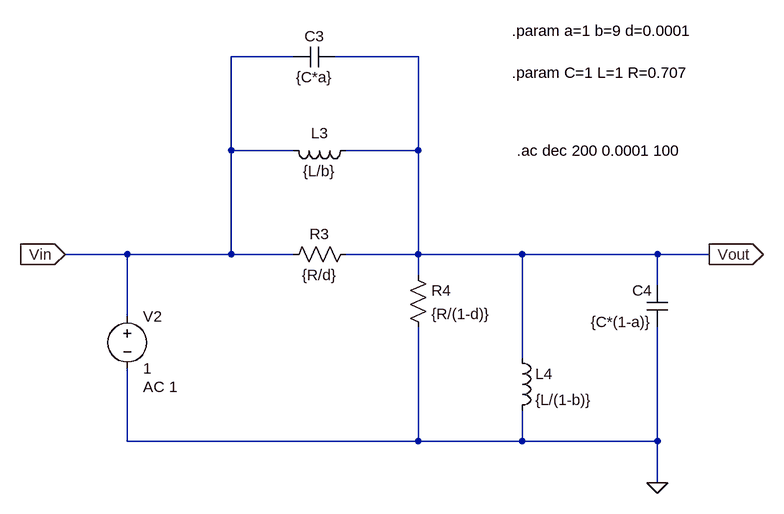
[diagram p0: schematic Draft1.asc]
Draft1.asc, the LTspice schematic file:
Version 4.1
SHEET 1 928 792
WIRE -1232 96 -1328 96
WIRE -1040 96 -1168 96
WIRE -1328 240 -1328 96
WIRE -1232 240 -1328 240
WIRE -1040 240 -1040 96
WIRE -1040 240 -1152 240
WIRE -1488 400 -1584 400
WIRE -1328 400 -1328 240
WIRE -1328 400 -1488 400
WIRE -1232 400 -1328 400
WIRE -1040 400 -1040 240
WIRE -1040 400 -1152 400
WIRE -880 400 -1040 400
WIRE -672 400 -880 400
WIRE -592 400 -672 400
WIRE -1040 432 -1040 400
WIRE -672 448 -672 400
WIRE -1488 496 -1488 400
WIRE -880 560 -880 400
WIRE -1488 688 -1488 576
WIRE -1040 688 -1040 512
WIRE -1040 688 -1488 688
WIRE -880 688 -880 640
WIRE -880 688 -1040 688
WIRE -672 688 -672 512
WIRE -672 688 -880 688
WIRE -672 752 -672 688
FLAG -672 752 0
FLAG -1584 400 Vin
IOPIN -1584 400 In
FLAG -592 400 Vout
IOPIN -592 400 Out
SYMBOL cap -1168 80 R90
WINDOW 0 0 32 VBottom 2
WINDOW 3 32 32 VTop 2
SYMATTR InstName C3
SYMATTR Value {C*a}
SYMBOL ind -1136 224 R90
WINDOW 0 5 56 VBottom 2
WINDOW 3 32 56 VTop 2
SYMATTR InstName L3
SYMATTR Value {L/b}
SYMBOL res -1248 416 R270
WINDOW 0 32 56 VTop 2
WINDOW 3 0 56 VBottom 2
SYMATTR InstName R3
SYMATTR Value {R/d}
SYMBOL res -1056 416 R0
SYMATTR InstName R4
SYMATTR Value {R/(1-d)}
SYMBOL ind -896 544 R0
SYMATTR InstName L4
SYMATTR Value {L/(1-b)}
SYMBOL cap -656 512 R180
WINDOW 0 24 56 Left 2
WINDOW 3 24 8 Left 2
SYMATTR InstName C4
SYMATTR Value {C*(1-a)}
SYMBOL voltage -1488 480 R0
WINDOW 123 24 124 Left 2
WINDOW 39 0 0 Left 0
SYMATTR InstName V2
SYMATTR Value 1
SYMATTR Value2 AC 1
TEXT -896 56 Left 2 !.param a=1 b=9 d=0.0001
TEXT -896 120 Left 2 !.param C=1 L=1 R=0.707
TEXT -888 240 Left 2 !.ac dec 200 0.0001 100

The netlist it stands for:
* Draft1.asc
C3 Vout Vin {C*a}
L3 Vout Vin {L/b}
R3 Vin Vout {R/d}
R4 Vout 0 {R/(1-d)}
L4 Vout 0 {L/(1-b)}
C4 0 Vout {C*(1-a)}
V2 Vin 0 1 AC 1
.param a=1 b=9 d=0.0001
.param C=1 L=1 R=0.707
.ac dec 200 0.0001 100
.backanno
.end